# EAGLE design flashlight (EAGLE 7.3.0)
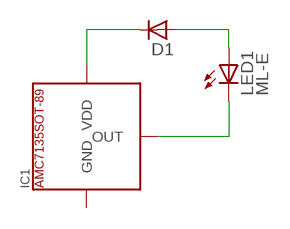
[diagram p0: schematic, sheet 1]

## Parts
D1  DIODE-RECTIFIER323  [DIODE323]
IC1  AMC7135SOT-89  [SOT89-R]
LED1  ML-E  [ML-E]

## Nets
N$3: IC1.2(OUT) LED1.C@1(C)
N$25: D1.C IC1.1(VDD)
N$28: LED1.A@1(A)
Unconnected: D1.A LED1.A@2(A) LED1.C@2(C) LED1.TH

## Power pins joined to a net without a drawn wire
GND: IC1.3(GND)

## Library data of the parts
D1 = chrisy-components:DIODE-RECTIFIER: Diode Rectifier
IC1 = esoteric-regulators:AMC7135: The AMC7135 is a low dropout current regulator rated for 350mA constant sink current. The low quiescent current and low dropout voltage are achieved by advanced Bi-CMOS process. 350mA constant sink current.  Output short / open circuit protection.  Low dropout voltage.  Low quiescent current  Supply voltage range 2.7V ~ 6V  2KV HBM ESD protection  Advanced Bi-CMOS process.  SOT-89 and TO-252 package
LED1 = led:ML-E: Cree® XLamp® ML-E LEDs 1/2 watt, 3.5 x 3.5 mm Source: Data sheet <http://www.cree.com/products/pdf/XLampML-E.pdf>

## Board
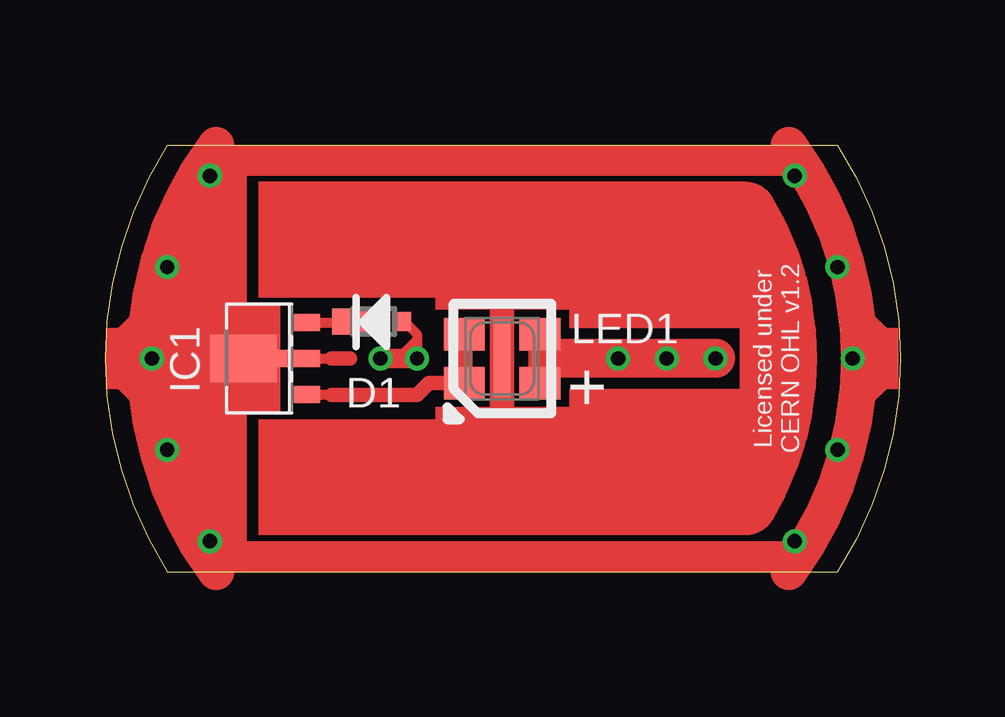
[diagram p1: board, top side]
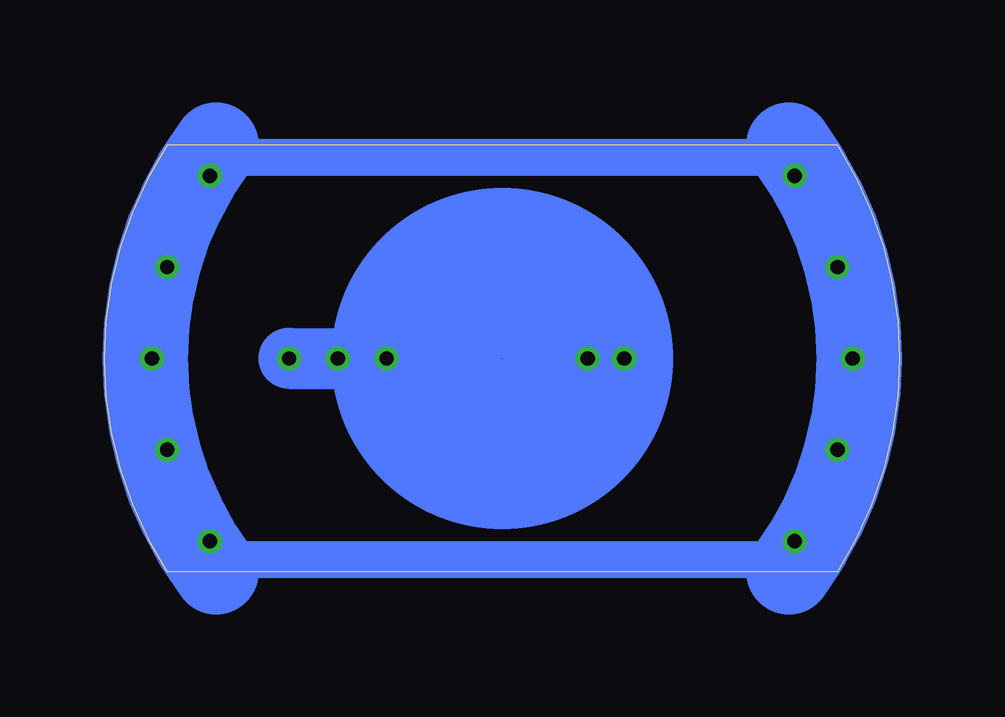
[diagram p2: board, bottom side, seen from below]

Size 33.16 x 17.78 mm. Coordinates in mm from the lower left corner, seen from the top.
Outline: 2.59,17.78 arc65 2.59,0 30.53,0 arc66 30.53,17.78 2.59,17.78
Copper layers (1*16): Top 0.035mm / dielectric 1.5mm / Bottom 0.035mm
Design rules "default": minimum track width 10mil, minimum drill 24mil, track to track 8mil, track to pad 8mil, pad to pad 8mil, via to via 8mil, smd to smd 8mil, copper to edge 40mil, drill to drill 8mil, minimum pad ring 10mil, minimum via ring 8mil, stop-mask expansion 4mil, vias tented up to drill 0mil, thermal gap 10mil

### Footprints (pad centres in the part's own frame; a part is rotated, then mirrored left to right if it is on the bottom)
DIODE323 = smd 0.8 x 0.8: A 1.15,0 | smd 2 x 1.1: C -0.75,0
SOT89-R = smd 0.7 x 1.1: 1 1.5,-1.75; 2 -1.5,-1.75 | smd 0.7 x 1.8: 3 0,-1.4 | smd 2 x 2.8: 4 0,0.9
ML-E = smd 1.7 x 1.35: A@1 1.575,-1.025; A@2 1.575,1.025; C@1 -1.575,-1.025; C@2 -1.575,1.025 | smd 0.7 x 3.2: TH 0,0

### Placement (x,y rotation side)
D1  11.21,10.43 0 top
IC1  6.67,8.89 90 top
LED1  16.55,8.88 0 top

### Tracks (layer width: path | path; a pad name or v marks a point on that pad's centre or on a via)
N$1  (via drill 0.6)
  Top 1.626: 5.13,8.89 v1.95,8.89
N$2  (via drill 0.6)
  other vias: 2.59,12.7
N$3
  Top 0.406: IC1.2 13.03,7.39 13.51,7.87 14.95,7.87 LED1.C@1
N$4  (via drill 0.6)
  other vias: 31.16,8.89
N$5
  Top 1.524: 28.5,17.78 arc-73 28.5,0
N$6  (via drill 0.6)
  other vias: 4.37,16.51
N$7  (via drill 0.6)
  other vias: 2.59,5.08
N$8  (via drill 0.6)
  other vias: 4.37,1.27
N$9  (via drill 0.6)
  other vias: 30.53,5.08
N$10  (via drill 0.6)
  other vias: 30.53,12.7
N$11
  Top 0.406: 15.29,12.7 16.56,11.43 17.83,12.7
N$12
  Top 0.61: 9.45,7.37 13,7.37 13.51,7.87 15.03,7.87 15.03,9.91
N$13  (via drill 0.6)
  other vias: 23.42,8.89
N$14
  Top 1.524: 4.62,17.78 arc73 4.62,0
N$15
  Top 0.406: 2.08,6.86 2.08,7.37 3.1,8.38 3.1,9.4 2.33,10.16
N$16
  Top 0.406: 0.56,7.87 1.57,6.86
N$17
  Top 0.406: 0.56,9.91 1.32,10.67
N$18
  Top 0.406: 32.56,9.91 31.8,10.67
N$19
  Top 0.406: 32.56,7.87 31.8,7.11
N$20  (via drill 0.6)
  other vias: 28.75,16.51
N$21  (via drill 0.6)
  other vias: 28.75,1.27
N$22
  Top 2.54: 26.72,14.99 arc-62 26.72,2.79
N$23
  Bottom 3.556: 4.62,17.78 arc73 4.62,0
N$24
  Bottom 3.556: 28.5,0 arc73 28.5,17.78
N$25
  Top 0.406: IC1.1 10.46,10.39 D1.C
N$26  (via drill 0.6)
  Top 0.406: 12.49,10.41 13,9.91 13,9.65 | 13,9.65 v13,8.89 | 13,9.65 12.24,8.89
  Top 0.813: v13,8.89 12.24,8.89 v11.48,8.89
N$27
  Top 0.406: 17.83,9.91 17.83,7.87
N$29  (via drill 0.6)
  Top 1.626: v25.45,8.89 18.59,8.89
  Bottom 2.54: v25.45,8.89 v21.38,8.89
N$30
  Top 0.406: 8.43,8.89 9.45,8.89
  Top 0.61: 9.45,8.89 10.21,8.89
(copper drawn outside any net)
  shapes: Bottom area x2, Bottom circle x1, Top area x21

### Text on the board
tNames: Licensed under / CERN OHL v1.2 | +
tStop: Stockton / Flashlight | Top Board / Rev. 3.3